# EAGLE design Evacuation_robot_arduino_shield (EAGLE 6.5.0)
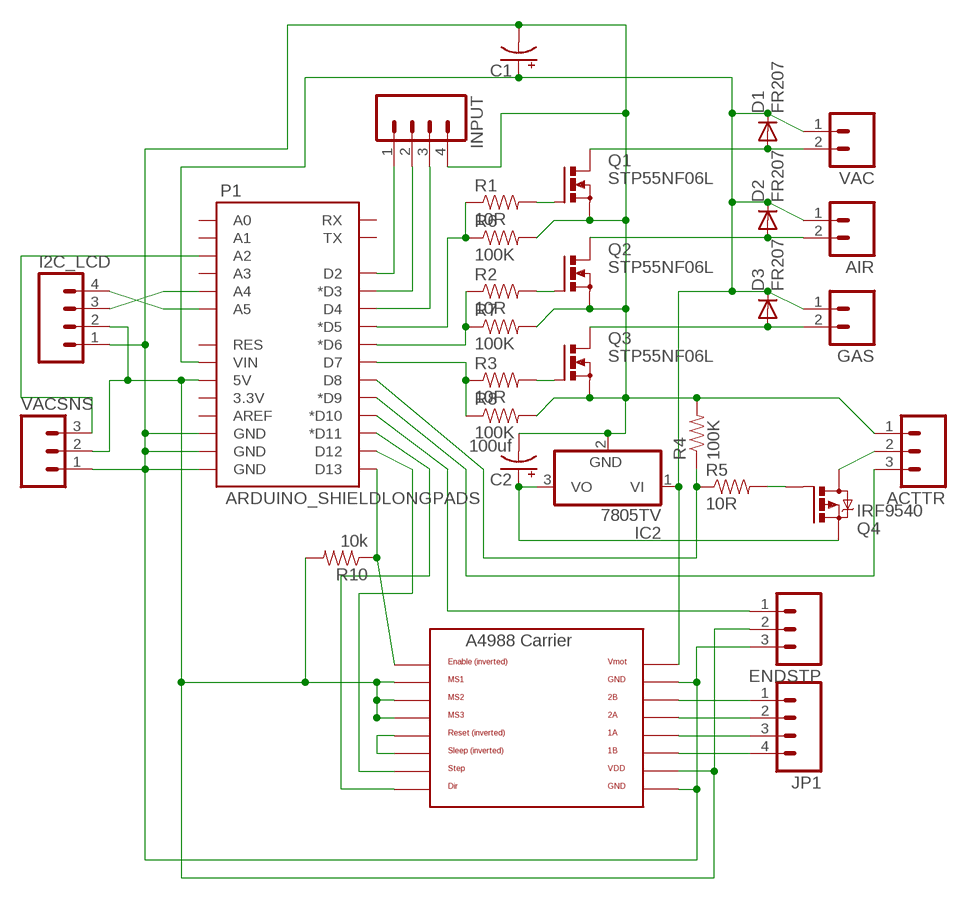
[diagram p0: schematic, sheet 1]

## Parts
ACTTR  M03LONGPADS  [1X03_LONGPADS]
AIR  M02PTH3  [1X02_LONGPADS]
C1  CAP_POLPTH4  [CPOL-RADIAL-1000UF-25V]
C2  100uf  CAP_POLPTH1  [CPOL-RADIAL-100UF-25V]
D1  FR207  DIODE1N4148  [DIODE-1N4148]
D2  FR207  DIODE1N4148  [DIODE-1N4148]
D3  FR207  DIODE1N4148  [DIODE-1N4148]
ENDSTP  M03LONGPADS  [1X03_LONGPADS]
GAS  M02PTH3  [1X02_LONGPADS]
I2C_LCD  M04LONGPADS  [1X04_LONGPADS]
IC2  7805TV  [TO220V]
INPUT  M04LONGPADS  [1X04_LONGPADS]
JP1  M04LONGPADS  [1X04_LONGPADS]
P1  ARDUINO_SHIELDLONGPADS  [DUEMILANOVE_SHIELD_LONGPADS]
Q1  STP55NF06L  PMOSFET_NTO220BV  [TO220BV]
Q2  STP55NF06L  PMOSFET_NTO220BV  [TO220BV]
Q3  STP55NF06L  PMOSFET_NTO220BV  [TO220BV]
Q4  IRF9540  IRF9530  [TO220BV]
R1  10R  RESISTORAXIAL-0.3  [AXIAL-0.3]
R2  10R  RESISTORAXIAL-0.3  [AXIAL-0.3]
R3  10R  RESISTORAXIAL-0.3  [AXIAL-0.3]
R4  100K  RESISTORAXIAL-0.3  [AXIAL-0.3]
R5  10R  RESISTORAXIAL-0.3  [AXIAL-0.3]
R6  100K  RESISTORAXIAL-0.3  [AXIAL-0.3]
R7  100K  RESISTORAXIAL-0.3  [AXIAL-0.3]
R8  100K  RESISTORAXIAL-0.3  [AXIAL-0.3]
R10  10k  RESISTORAXIAL-0.3  [AXIAL-0.3]
U$1  A4988BREAKOUT  [A4988BREAKOUT]
VAC  M02PTH3  [1X02_LONGPADS]
VACSNS  M03LONGPADS  [1X03_LONGPADS]

## Nets
N$1: INPUT.3 P1.D4
N$2: INPUT.2 P1.D3(*D3)
N$3: P1.D6(*D6) R2.P$1 R7.P$1
N$4: P1.D7 R3.P$1 R8.P$1
N$5: P1.D5(*D5) R1.P$1 R6.P$1
N$6: ENDSTP.1 P1.D10(*D10)
N$7: Q1.G R1.P$2
N$8: JP1.1 U$1.2B
N$9: INPUT.1 P1.D2
N$10: Q3.G R3.P$2
N$11: Q2.G R2.P$2
N$12: D1.A Q1.D VAC.2
N$13: AIR.2 D2.A Q2.D
N$14: D3.A GAS.2 Q3.D
N$15: I2C_LCD.3 P1.A4
N$16: JP1.2 U$1.2A
N$17: I2C_LCD.4 P1.A5
N$18: AIR.1 C1.1(+) D1.C D2.C D3.C GAS.1 IC2.1(VI) P1.VIN U$1.VMOT VAC.1
N$19: JP1.3 U$1.1A
N$20: JP1.4 U$1.1B
N$21: U$1.RST U$1.SLP(SLEEP)
N$22: ACTTR.3 P1.D9(*D9)
N$23: Q4.G R5.P$2
N$24: P1.D13 R10.P$1 U$1.EN
N$25: P1.D11(*D11) U$1.DIR
N$26: P1.D8 R4.P$1 R5.P$1
N$27: P1.A2 VACSNS.3
N$28: C2.1(+) IC2.3(VO) Q4.S
N$29: P1.D12 U$1.STEP
N$30: ACTTR.2 Q4.D
N$31: ENDSTP.2 I2C_LCD.2 P1.5V R10.P$2 U$1.MS1 U$1.MS2 U$1.MS3 U$1.VDD VACSNS.2
N$36: ACTTR.1 C1.2(-) C2.2(-) ENDSTP.3 I2C_LCD.1 IC2.2(GND) INPUT.4 P1.GND@0(GND) P1.GND@1(GND) P1.GND@2(GND) Q1.S Q2.S Q3.S R4.P$2 R6.P$2 R7.P$2 R8.P$2 U$1.GND U$1.GND@0(GND) VACSNS.1
Unconnected: P1.3.3V P1.A0 P1.A1 P1.A3 P1.AREF P1.RES P1.RX P1.TX

## Library data of the parts
ACTTR ENDSTP VACSNS = SparkFun-Connectors:M03: Header 3 Standard 3-pin 0.1" header. Use with straight break away headers (SKU : PRT-00116), right angle break away headers (PRT-00553), swiss pins (PRT-00743), machine pins (PRT-00117), and female headers (PRT-00115). Molex polarized connector foot print use with SKU : PRT-08232 with associated crimp pins and housings.
AIR GAS VAC = SparkFun-Connectors:M02: Header 2 Standard 2-pin 0.1" header. Use with straight break away headers (SKU : PRT-00116), right angle break away headers (PRT-00553), swiss pins (PRT-00743), machine pins (PRT-00117), and female headers (PRT-00115). Molex polarized connector foot print use with SKU : PRT-08233 with associated crimp pins and housings.
C1 C2 = SparkFun-Passives:CAP_POL: Capacitor Polarized These are standard SMD and PTH capacitors. Normally 10uF, 47uF, and 100uF in electrolytic and tantalum varieties. Always verify the external diameter of the through hole cap, it varies with capacity, voltage, and manufacturer. The EIA devices should be standard.
D1-D3 = SparkFun-DiscreteSemi:DIODE: Diode These are standard reverse protection diodes and small signal diodes. SMA package can handle up to about 1A. SOD-323 can handle about 200mA. What the SOD-323 package when ordering, there are some mfgs out there that are 5-pin packages.
I2C_LCD INPUT JP1 = SparkFun-Connectors:M04: Header 4 Standard 4-pin 0.1" header. Use with straight break away headers (SKU : PRT-00116), right angle break away headers (PRT-00553), swiss pins (PRT-00743), machine pins (PRT-00117), and female headers (PRT-00115). Molex polarized connector foot print use with SKU : PRT-08231 with associated crimp pins and housings. 1MM SMD Version SKU: PRT-10208
IC2 = linear:78*: Positive VOLTAGE REGULATOR Source: http://cache.national.com/ds/LM/LM78L05.pdf http://www.fairchildsemi.com/ds/LM/LM7805.pdf
P1 = SparkFun-Boards:ARDUINO_SHIELD: Arduino shield footprint
Q1-Q3 = transistor-power:PMOSFET_N: Power MOSFET N-Channel
Q4 = transistor-power:IRF9530: P-CHANNEL HEXFET POWER-MOS-FET Source: http://www.irf.com/product-info/datasheets/data/irf9530.pdf
R1-R8 R10 = SparkFun-Passives:RESISTOR: Resistor Basic schematic elements and footprints for 0603, 1206, and PTH resistors.
U$1 = RepRapjr:A4988BREAKOUT

## Board
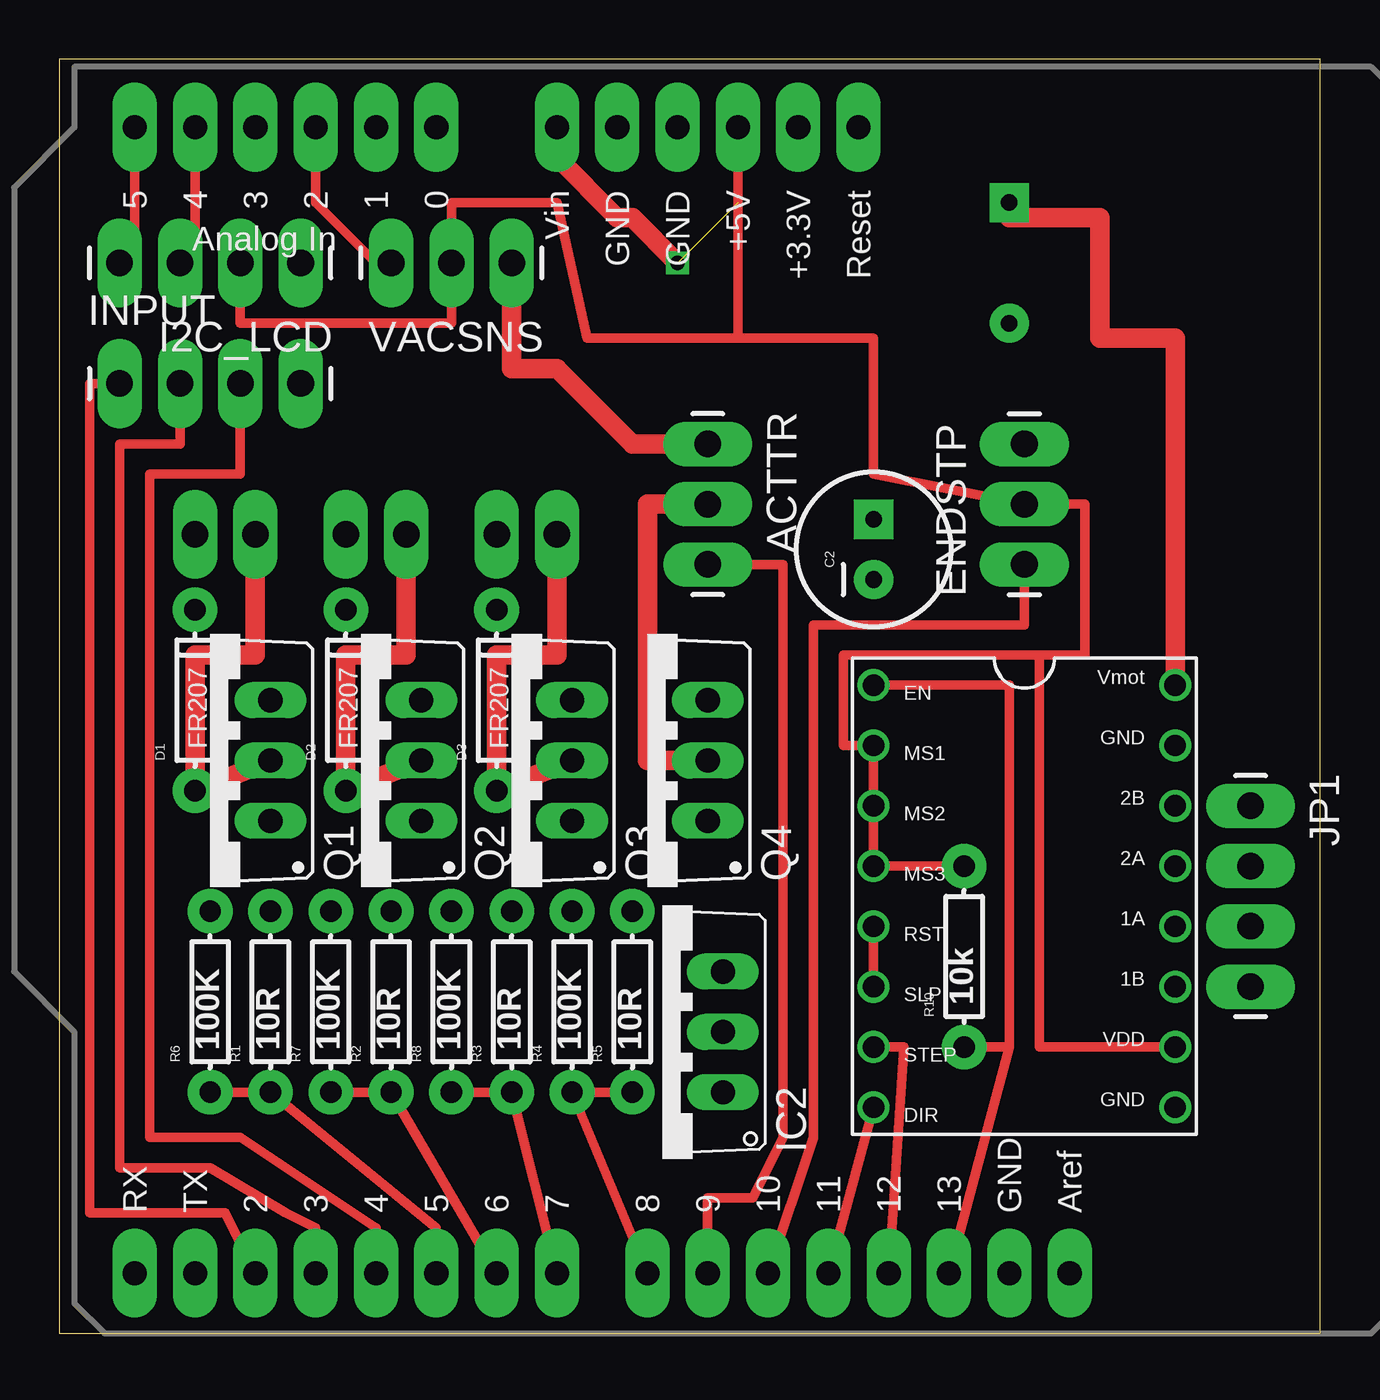
[diagram p1: board, top side]
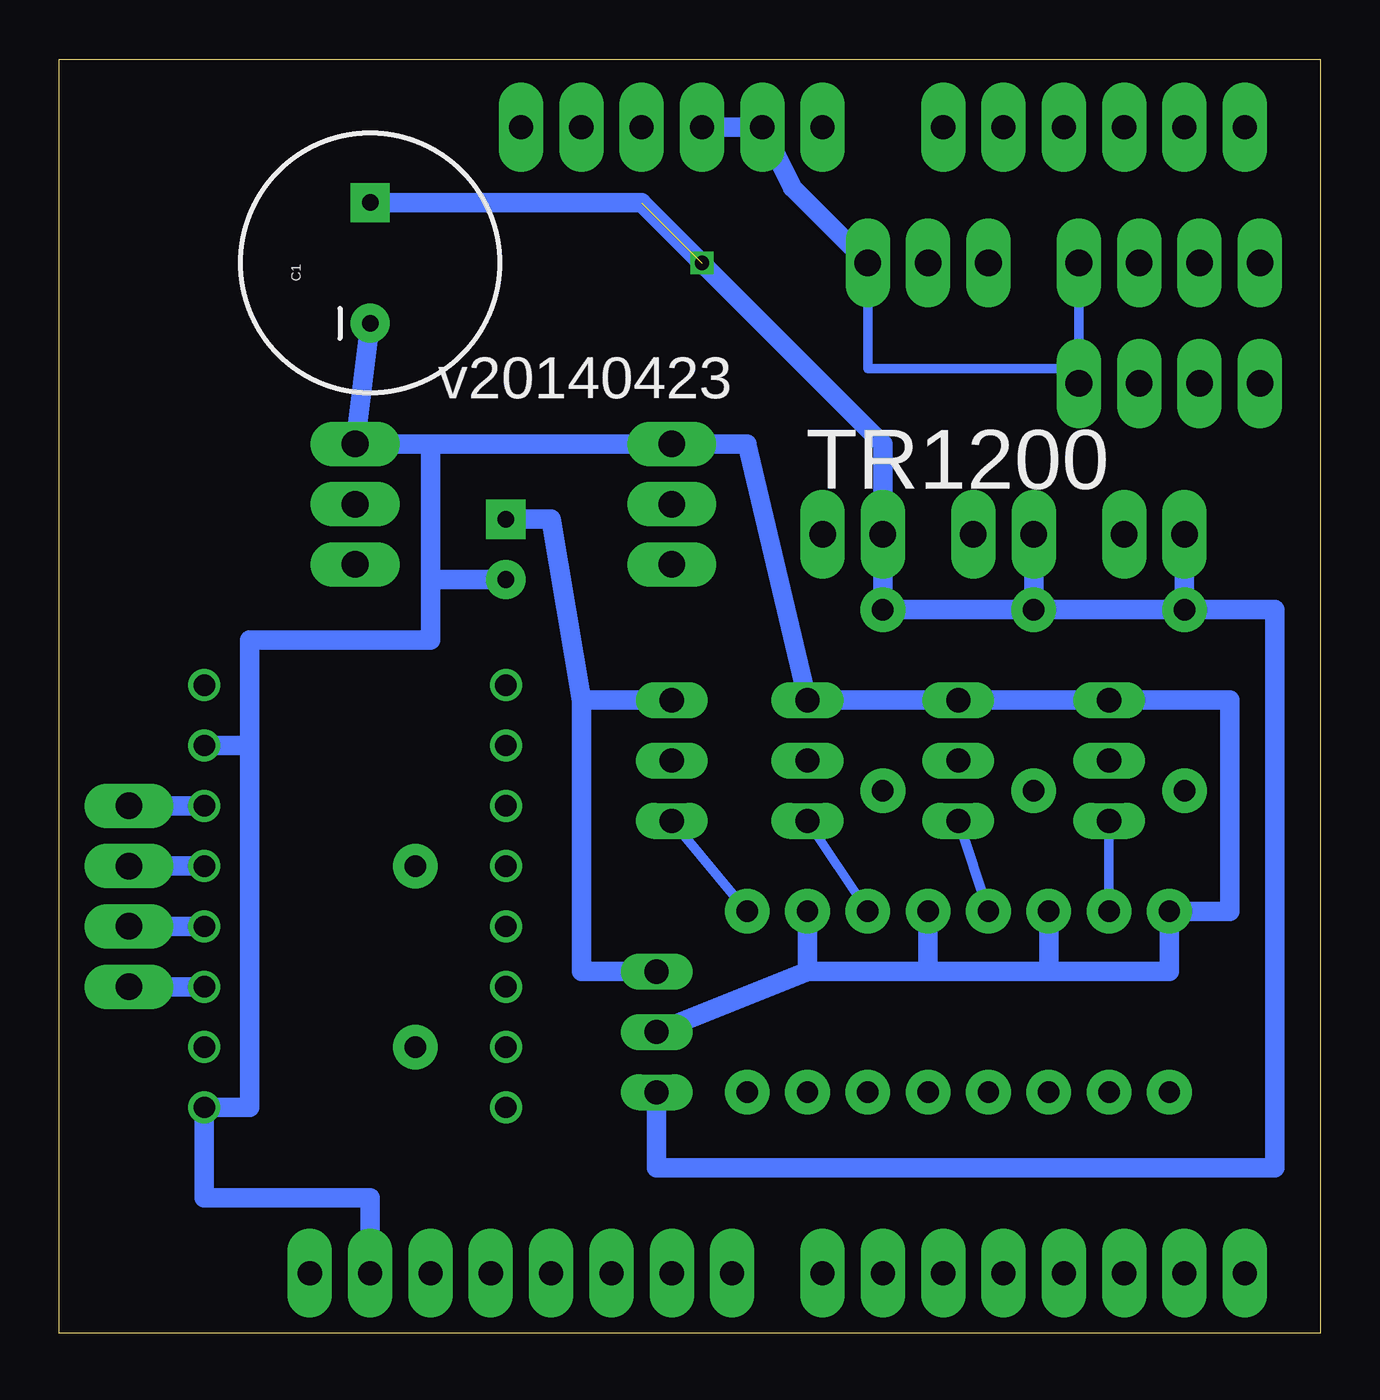
[diagram p2: board, bottom side, seen from below]

Size 53.09 x 53.66 mm. Coordinates in mm from the lower left corner, seen from the top.
Copper layers (1*16): Top 0.0356mm / dielectric 1.5011mm / Bottom 0.0356mm
Design rules "default": minimum track width 6mil, minimum drill 13mil, track to track 6mil, track to pad 6mil, pad to pad 6mil, via to via 6mil, smd to smd 6mil, copper to edge 15mil, drill to drill 6mil, minimum pad ring 7mil, minimum via ring 7mil, stop-mask expansion 4mil, vias tented up to drill 0mil, thermal gap 10mil

### Footprints (pad centres in the part's own frame; a part is rotated, then mirrored left to right if it is on the bottom)
1X03_LONGPADS = drill 1.118 pad 1.88 long: 1 0,0; 2 2.54,0; 3 5.08,0
1X02_LONGPADS = drill 1.118 pad 1.88 long: 1 0,0; 2 2.54,0
CPOL-RADIAL-1000UF-25V = drill 0.7 pad 1.651 square: 1 2.54,0 | drill 0.7 pad 1.651: 2 -2.54,0
CPOL-RADIAL-100UF-25V = drill 0.7 pad 1.651 square: 1 1.27,0 | drill 0.7 pad 1.651: 2 -1.27,0
DIODE-1N4148 = drill 0.9 pad 1.88: A -3.81,0; C 3.81,0
1X04_LONGPADS = drill 1.118 pad 1.88 long: 1 0,0; 2 2.54,0; 3 5.08,0; 4 7.62,0
TO220V = drill 1.016 long: 1 -2.54,-2.54; 2 0,-2.54; 3 2.54,-2.54
DUEMILANOVE_SHIELD_LONGPADS = drill 1.016 pad 1.88 long: 3.3V 50.8,26.67; 5V 50.8,29.21; A0 50.8,41.91; A1 50.8,44.45; A2 50.8,46.99; A3 50.8,49.53; A4 50.8,52.07; A5 50.8,54.61; AREF 2.54,15.24; D2 2.54,49.53; D3 2.54,46.99; D4 2.54,44.45; D5 2.54,41.91; D6 2.54,39.37; D7 2.54,36.83; D8 2.54,33.02; D9 2.54,30.48; D10 2.54,27.94; D11 2.54,25.4; D12 2.54,22.86; D13 2.54,20.32; GND@0 50.8,31.75; GND@1 50.8,34.29; GND@2 2.54,17.78; RES 50.8,24.13; RX 2.54,54.61; TX 2.54,52.07; VIN 50.8,36.83
TO220BV = drill 1.016 long: D 0,-2.54; G -2.54,-2.54; S 2.54,-2.54
AXIAL-0.3 = drill 0.9 pad 1.88: P$1 -3.81,0; P$2 3.81,0
A4988BREAKOUT = drill 0.9: 1A 8.89,1.27; 1B 11.43,1.27; 2A 6.35,1.27; 2B 3.81,1.27; DIR 16.51,-11.43; EN -1.27,-11.43; GND 16.51,1.27; GND@0 1.27,1.27; MS1 1.27,-11.43; MS2 3.81,-11.43; MS3 6.35,-11.43; RST 8.89,-11.43; SLP 11.43,-11.43; STEP 13.97,-11.43; VDD 13.97,1.27; VMOT -1.27,1.27

### Placement (x,y rotation side)
ACTTR  27.3,37.47 270 top
AIR  12.06,33.66 0 top
C1  40,45.09 90 bottom
C2  34.29,33.02 90 top
D1  5.71,26.67 90 top
D2  12.06,26.67 90 top
D3  18.41,26.67 90 top
ENDSTP  40.64,32.38 90 top
GAS  18.41,33.66 0 top
I2C_LCD  10.16,45.09 180 top
IC2  25.4,12.7 90 top
INPUT  2.54,40.01 0 top
JP1  50.16,22.23 270 top
P1  57.78,0 90 top
Q1  6.35,24.13 90 top
Q2  12.7,24.13 90 top
Q3  19.05,24.13 90 top
Q4  24.77,24.13 90 top
R1  8.89,13.97 90 top
R2  13.97,13.97 90 top
R3  19.05,13.97 90 top
R4  21.59,13.97 90 top
R5  24.13,13.97 90 top
R6  6.35,13.97 90 top
R7  11.43,13.97 90 top
R8  16.51,13.97 90 top
R10  38.1,15.88 90 top
U$1  45.72,26.04 270 top
VAC  5.71,33.66 0 top
VACSNS  19.05,45.09 180 top

### Tracks (layer width: path | path; a pad name or v marks a point on that pad's centre or on a via)
N$1
  Top 0.406: P1.D4 13.33,4.45 7.62,8.26 3.81,8.26 3.81,36.2 7.62,36.2 INPUT.3
N$2
  Top 0.406: P1.D3 10.79,4.45 9.52,5.08 6.35,6.99 2.54,6.99 2.54,37.47 5.08,37.47 INPUT.2
N$3
  Top 0.406: R7.P$1 R2.P$1 P1.D6
N$4
  Top 0.406: R8.P$1 R3.P$1 P1.D7
N$5
  Top 0.406: R6.P$1 R1.P$1 15.88,4.45 P1.D5
N$6
  Top 0.406: P1.D10 31.75,8.26 31.75,29.84 40.64,29.84 ENDSTP.1
N$7
  Bottom 0.406: R1.P$2 Q1.G
N$8
  Bottom 0.813: U$1.2B JP1.1
N$9
  Top 0.406: P1.D2 6.98,5.08 1.27,5.08 1.27,40.01 INPUT.1
N$10
  Bottom 0.406: R3.P$2 Q3.G
N$11
  Bottom 0.406: R2.P$2 Q2.G
N$12
  Top 0.813: Q1.D D1.A 5.71,28.57 8.25,28.57 VAC.2
N$13
  Top 0.813: Q2.D D2.A 12.06,28.57 14.61,28.57 AIR.2
N$14
  Top 0.813: Q3.D D3.A 18.41,28.57 20.95,28.57 GAS.2
N$15
  Top 0.406: I2C_LCD.3 5.71,45.09 P1.A4
N$16
  Bottom 0.813: U$1.2A JP1.2
N$17
  Top 0.406: I2C_LCD.4 3.17,45.09 P1.A5
N$18  (1 unrouted)
  Top 0.813: U$1.VMOT 46.99,41.91 43.81,41.91 43.81,46.99 40,46.99 C1.1 | P1.VIN 20.95,49.53 23.49,46.99 24.13,46.99 26.04,45.09
  Bottom 0.813: D1.C D2.C | D2.C D3.C GAS.1 18.41,37.47 28.57,47.62 C1.1 | AIR.1 D2.C | VAC.1 D1.C | IC2.1 27.94,6.99 1.9,6.99 1.9,30.48 D1.C
N$19
  Bottom 0.813: U$1.1A JP1.3
N$20
  Bottom 0.813: U$1.1B JP1.4
N$21
  Top 0.406: U$1.RST U$1.SLP
N$22
  Top 0.406: P1.D9 27.3,5.71 29.21,5.71 30.48,8.26 30.48,32.38 ACTTR.3
N$23
  Bottom 0.406: R5.P$2 Q4.G
N$24
  Top 0.406: U$1.EN 40,27.3 40,12.06 | 40,12.06 P1.D13 | R10.P$1 40,12.06
N$25
  Top 0.406: P1.D11 U$1.DIR
N$26
  Top 0.406: P1.D8 R4.P$1 R5.P$1
N$27
  Top 0.406: VACSNS.3 13.33,45.09 10.79,47.62 P1.A2
N$28
  Bottom 0.813: IC2.3 31.12,15.24 31.12,26.67 | 31.12,26.67 Q4.S | 31.12,26.67 32.38,34.29 C2.1
N$29
  Top 0.406: P1.D12 35.56,12.06 U$1.STEP
N$30
  Top 0.813: ACTTR.2 24.77,34.92 24.77,24.13 Q4.D
N$31
  Top 0.406: 28.57,41.91 P1.5V | U$1.VDD 41.27,12.06 41.27,28.57 | 41.27,28.57 43.18,28.57 43.18,34.92 ENDSTP.2 34.29,36.2 34.29,41.91 28.57,41.91 | 41.27,28.57 33.02,28.57 33.02,24.77 U$1.MS1 U$1.MS2 U$1.MS3 R10.P$2 | 28.57,41.91 22.22,41.91 20.95,47.62 16.51,47.62 VACSNS.2 16.51,42.55 7.62,42.55 I2C_LCD.2
N$32  (via drill 0.6)
  other vias: 26.04,45.09
N$36
  Top 0.813: VACSNS.1 19.05,40.64 20.95,40.64 24.13,37.47 ACTTR.1
  Bottom 0.406: I2C_LCD.1 INPUT.4 10.79,40.64 19.05,40.64 VACSNS.1
  Bottom 0.813: Q1.S Q2.S Q3.S | P1.GND@0 P1.GND@1 22.22,48.26 VACSNS.1 | C1.2 ENDSTP.3 37.46,37.47 | P1.GND@2 40,5.71 46.99,5.71 U$1.GND 45.09,9.53 45.09,24.77 | U$1.GND@0 45.09,24.77 | 45.09,24.77 45.09,29.21 37.46,29.21 37.46,31.75 | C2.2 37.46,31.75 | 37.46,31.75 37.46,37.47 | 11.43,15.24 6.35,15.24 R6.P$2 3.81,17.78 3.81,26.67 Q1.S | R7.P$2 11.43,15.24 | 11.43,15.24 16.51,15.24 | R8.P$2 16.51,15.24 | 16.51,15.24 21.59,15.24 | 21.59,15.24 R4.P$2 | 21.59,15.24 IC2.2 | Q3.S Q1.S | Q3.S 24.13,37.47 ACTTR.1 37.46,37.47

### Text on the board
_bsilk: v20140423 | TR1200